# Altium schematic sheet PowerSupply.SchDoc
size A
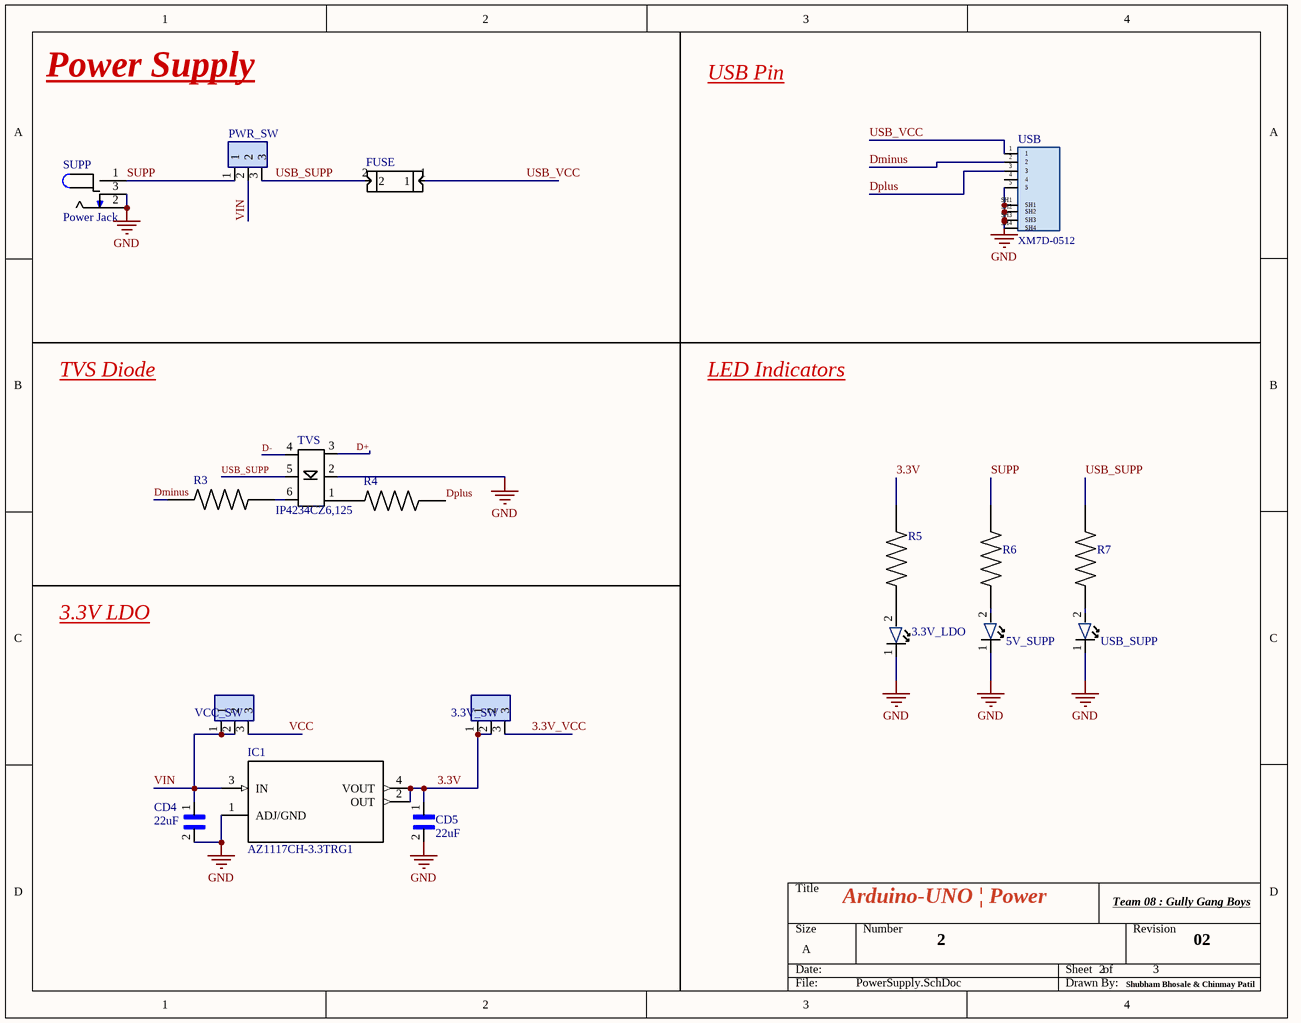
[diagram p0: PowerSupply.SchDoc]

## Parts
3.3V_LDO  LTST-C150CKT  [LED]  (value not drawn)
3.3V_SW  PREC003SAAN-RC  [3_PIN]  (value not drawn)
5V_SUPP  LTST-C150CKT  [LED]  (value not drawn)
CD4  22uF  [1206_Passive]
CD5  22uF  [1206_Passive]
FUSE  MF-MSMF050-2  [FUSE]  (value not drawn)
IC1  AZ1117CH-3.3TRG1  [LDO]
PWR_SW  PREC003SAAN-RC  [3_PIN]  (value not drawn)
R3  RMCF1206JT300R‎  [1206_Passive]  (value not drawn)
R4  RMCF1206JT300R‎  [1206_Passive]  (value not drawn)
R5  RNCP1206FTD1K00  [1206_Passive]  (value not drawn)
R6  RNCP1206FTD1K00  [1206_Passive]  (value not drawn)
R7  RNCP1206FTD1K00  [1206_Passive]  (value not drawn)
SUPP  Power Jack  [Power_Jack]
TVS  IP4234CZ6,125  [TVS]
USB  XM7D-0512  [USB]
USB_SUPP  LTST-C150CKT  [LED]  (value not drawn)
VCC_SW  PREC003SAAN-RC  [3_PIN]  (value not drawn)

## Nets
GND: 3.3V_LDO.1 5V_SUPP.1 CD4.2 CD5.2 IC1.1(ADJ/GND) SUPP.2 SUPP.3 TVS.2 USB.5 USB.SH1 USB.SH2 USB.SH3 USB.SH4 USB_SUPP.1
3.3V: 3.3V_SW.1 3.3V_SW.2 CD5.1 IC1.2(OUT) IC1.4(VOUT) R5.2
3.3V_VCC: 3.3V_SW.3
D+: TVS.3
D-: TVS.4
Dminus: R3.1 USB.2
Dplus: R4.2 USB.3
SUPP: PWR_SW.1 R6.1 SUPP.1
USB_SUPP: FUSE.2 PWR_SW.3 R7.1 TVS.5
USB_VCC: FUSE.1 USB.1
VCC: VCC_SW.3
VIN: CD4.1 IC1.3(IN) PWR_SW.2 VCC_SW.1 VCC_SW.2
Net3.3V_LDO_2: 3.3V_LDO.2 R5.1
Net5V_SUPP_2: 5V_SUPP.2 R6.2
NetR3_2: R3.2 TVS.6
NetR4_1: R4.1 TVS.1
NetR7_2: R7.2 USB_SUPP.2

Not connected (* = marked no-connect by the designer): USB 4

## Notes on the sheet
- Power Supply
- USB Pin
- TVS Diode
- LED Indicators
- 3.3V LDO
- Arduino-UNO | Power
- Team 08 : Gully Gang Boys
- 2
- 3
- 02
- Shubham Bhosale & Chinmay Patil

## Library data of the parts
3.3V_LDO 5V_SUPP USB_SUPP = 1206_RED_LED: Red 638nm LED Indication - Discrete 1.8V 1206 (3216 Metric); Value: LED RED CLEAR 1206 SMD; Digikey Link: https://www.digikey.com/product-detail/en/LTST-C150CKT/160-1167-1-ND/269239/?itemSeq=304982368; Digikey Part: 160-1167-1-ND
3.3V_SW PWR_SW VCC_SW = 3_PIN: Connector Header Through Hole 3 position 0.100" (2.54mm); Value: CONN HEADER VERT 3POS 2.54MM; Digikey Link: https://www.digikey.com/product-detail/en/PREC003SAAN-RC/S1012EC-03-ND/2774851/?itemSeq=304982371; Digikey Part: S1012EC-03-ND
CD4 CD5 = 1206_22uF: 22µF ±20% 16V Ceramic Capacitor X5R 1206 (3216 Metric); Value: CAP CER 22UF 16V X5R 1206; Digikey Link: https://www.digikey.com/product-detail/en/CL31A226MOCLNNC/1276-2728-1-ND/3890814/?itemSeq=304982363; Digikey Part: 1276-2728-1-ND
FUSE = Fuse: Polymeric PTC Resettable Fuse 15V 500mA Ih Surface Mount 1812 (4532 Metric), Concave; Value: PTC RESET FUSE 15V 500MA 1812; Digikey Link: https://www.digikey.com/product-detail/en/MF-MSMF050-2/MF-MSMF050-2CT-ND/662842/?itemSeq=304982360; Digikey Part: MF-MSMF050-2CT-ND
IC1 = 3.3V_LDO: Linear Voltage Regulator IC Positive Fixed 1 Output 1A SOT-223; Value: IC REG LINEAR 3.3V 800MA SOT223; Digikey Link: https://www.digikey.com/product-detail/en/AZ1117CH-3.3TRG1/AZ1117CH-3.3TRG1DICT-ND/4505206/?itemSeq=304982370; Digikey Part: AZ1117CH-3.3TRG1DICT-ND
R3 R4 = 1206_300Ohm: 300 Ohms ±5% 0.25W, 1/4W Chip Resistor 1206 (3216 Metric) Automotive AEC-Q200 Thick Film; Value: 300Ohm; Digikey Link: https://www.digikey.com/product-detail/en/RMCF1206JT300R/RMCF1206JT300RCT-ND/1942776/?itemSeq=304982374; Digikey Part: RMCF1206JT300RCT-ND
R5-R7 = 1206_1K: 1 kOhms ±1% 0.5W, 1/2W Chip Resistor 1206 (3216 Metric) Anti-Sulfur, Moisture Resistant Thin Film; Value: RES 1K OHM 1% 1/2W 1206; Digikey Link: https://www.digikey.com/product-detail/en/RNCP1206FTD1K00/RNCP1206FTD1K00CT-ND/2240675/?itemSeq=304982373; Digikey Part: RNCP1206FTD1K00CT-ND
SUPP = Power Jack: Power Barrel Connector Jack 2.10mm ID (0.083"), 5.50mm OD (0.217") Through Hole, Right Angle; Value: CONN PWR JACK 2X5.5MM SOLDER; Digikey Link: https://www.digikey.com/product-detail/en/PJ-102A/CP-102A-ND/275425/?itemSeq=304982367; Digikey Part: CP-102A-ND
TVS = TVS_Diode: Clamp Ipp Tvs Diode Surface Mount 6-TSOP; Value: TVS DIODE 5.5V 6TSOP; Digikey Part: 1727-4717-1-ND; Digikey Link: https://www.digikey.com/product-detail/en/IP4234CZ6%2c125/1727-4717-1-ND/2531156/?itemSeq=304982369
USB = USB: USB - mini B USB 2.0 Receptacle Connector 5 Position Through Hole, Right Angle; Value: CONN RCPT USB2.0 MINI B 5P R/A; Digikey Link: https://www.digikey.com/product-detail/en/XM7D-0512/OR1205-ND/4695531/?itemSeq=304982356; Digikey Part: OR1205-ND